# EAGLE schematic P27_v3 (EAGLE 6.5.0)
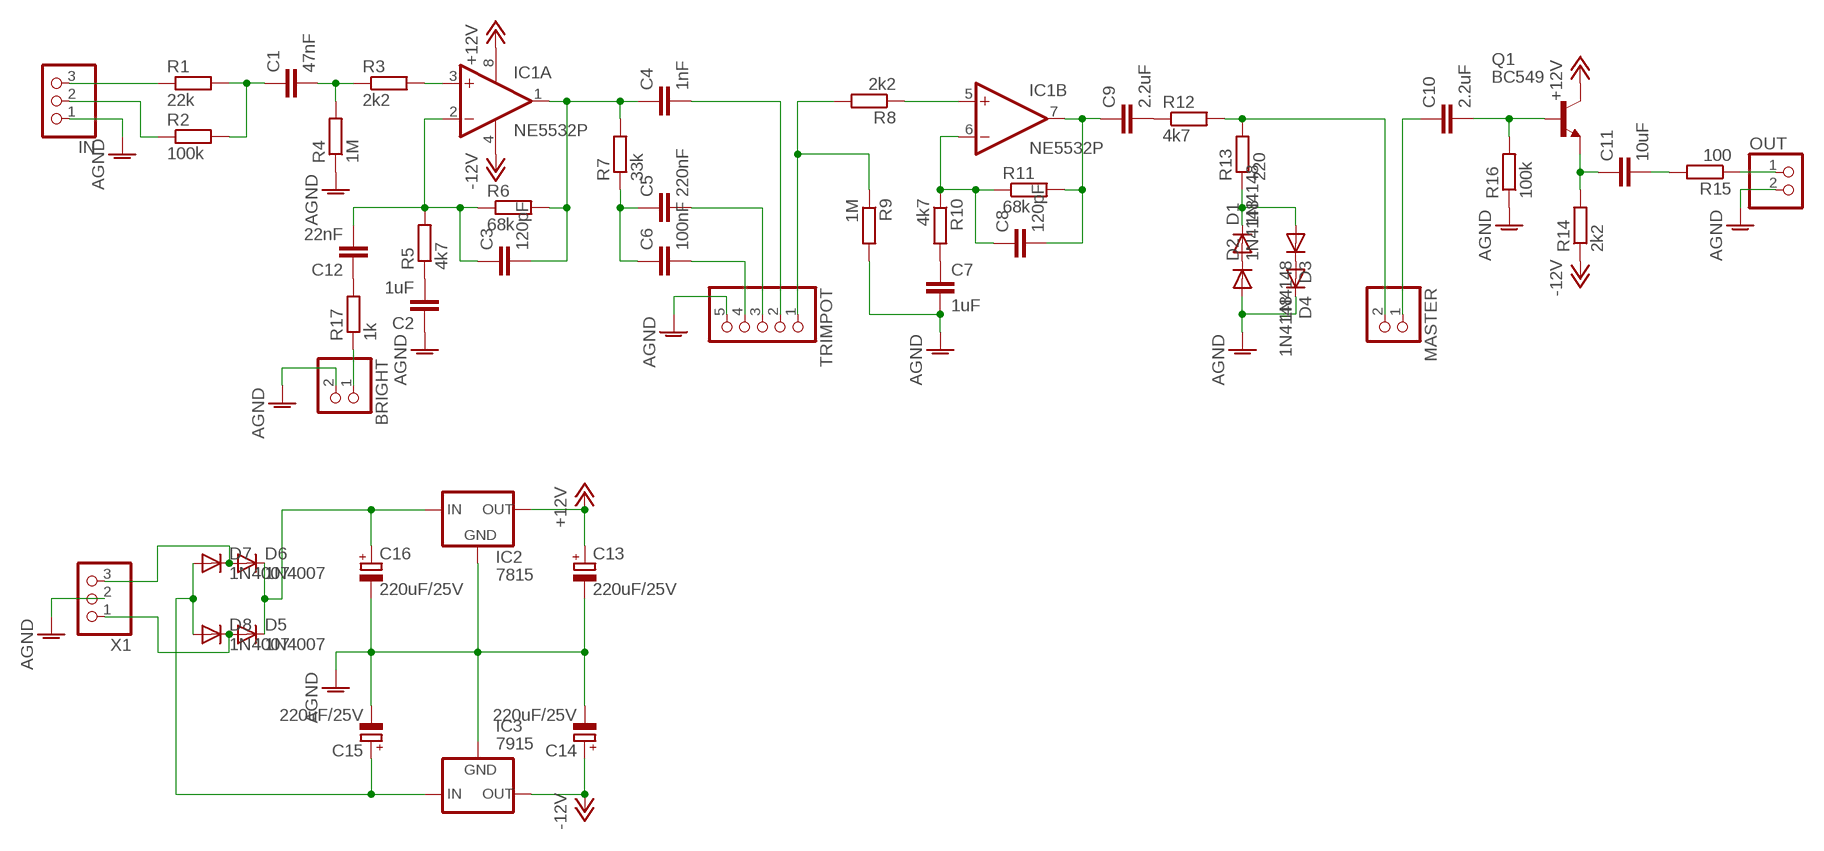
[diagram p0: schematic, sheet 1]

## Parts
BRIGHT  PINHD-1X2  [1X02]
C1  47nF  C-EU050-025X075  [C050-025X075]
C2  1uF  C-EU050-025X075  [C050-025X075]
C3  120pF  C-EU050-025X075  [C050-025X075]
C4  1nF  C-EU050-025X075  [C050-025X075]
C5  220nF  C-EU050-025X075  [C050-025X075]
C6  100nF  C-EU050-025X075  [C050-025X075]
C7  1uF  C-EU050-025X075  [C050-025X075]
C8  120pF  C-EU050-025X075  [C050-025X075]
C9  2.2uF  C-EU050-025X075  [C050-025X075]
C10  2.2uF  C-EU050-025X075  [C050-025X075]
C11  10uF  C-EU050-025X075  [C050-025X075]
C12  22nF  C-EU050-025X075  [C050-025X075]
C13  220uF/25V  CPOL-EUE2.5-6  [E2,5-6]
C14  220uF/25V  CPOL-EUE2.5-6  [E2,5-6]
C15  220uF/25V  CPOL-EUE2.5-6  [E2,5-6]
C16  220uF/25V  CPOL-EUE2.5-6  [E2,5-6]
D1  1N4148  1N4004D  [DO41-7]
D2  1N4148  1N4004D  [DO41-7]
D3  1N4148  1N4004D  [DO41-7]
D4  1N4148  1N4004D  [DO41-7]
D5  1N4007  1N4004D  [DO41-7]
D6  1N4007  1N4004D  [DO41-7]
D7  1N4007  1N4004D  [DO41-7]
D8  1N4007  1N4004D  [DO41-7]
IC1  NE5532P  [DIL08]
IC2  7815  78XXTO-220  [78XXS]
IC3  7915  79XXTO-220  [79XXS]
IN  PINHD-1X3180  [1X03]
MASTER  PINHD-1X2  [1X02]
OUT  PINHD-1X2  [1X02]
Q1  BC549  BC337  [TO92]
R1  22k  R-EU_0207/7  [0207/7]
R2  100k  R-EU_0207/7  [0207/7]
R3  2k2  R-EU_0207/7  [0207/7]
R4  1M  R-EU_0207/7  [0207/7]
R5  4k7  R-EU_0207/7  [0207/7]
R6  68k  R-EU_0207/7  [0207/7]
R7  33k  R-EU_0207/7  [0207/7]
R8  2k2  R-EU_0207/7  [0207/7]
R9  1M  R-EU_0207/7  [0207/7]
R10  4k7  R-EU_0207/7  [0207/7]
R11  68k  R-EU_0207/7  [0207/7]
R12  4k7  R-EU_0207/7  [0207/7]
R13  220  R-EU_0207/7  [0207/7]
R14  2k2  R-EU_0207/7  [0207/7]
R15  100  R-EU_0207/7  [0207/7]
R16  100k  R-EU_0207/7  [0207/7]
R17  1k  R-EU_0207/7  [0207/7]
TRIMPOT  PINHD-1X5  [1X05]
X1  W237-103  [W237-103]

## Nets
+12V: C13.+ IC1.8(A:V+) IC2.OUT Q1.3(C)
-12V: C14.+ IC1.4(A:V-) IC3.OUT R14.1
AGND: BRIGHT.2 C2.1 C7.2 C13.- C14.- C15.- C16.- D2.A D4.C IC2.GND IC3.GND IN.1 OUT.2 R4.1 R9.2 R16.1 TRIMPOT.5 X1.2
N$1: C1.1 R1.2 R2.2
N$2: IC1.3(A:+IN) R3.2
N$3: C1.2 R3.1 R4.2
N$4: C3.1 C12.2 IC1.2(A:-IN) R5.2 R6.1
N$5: C2.2 R5.1
N$6: C3.2 C4.1 IC1.1(A:OUT) R6.2 R7.2
N$7: C6.2 TRIMPOT.4
N$8: C5.1 C6.1 R7.1
N$9: C5.2 TRIMPOT.3
N$10: C4.2 TRIMPOT.2
N$11: C10.2 Q1.2(B) R16.2
N$12: C7.1 R10.2
N$13: R8.2 R9.1 TRIMPOT.1
N$14: IC1.5(B:+IN) R8.1
N$15: C11.1 Q1.1(E) R14.2
N$16: C11.2 R15.2
N$17: C8.1 IC1.6(B:-IN) R10.1 R11.1
N$18: C8.2 C9.1 IC1.7(B:OUT) R11.2
N$19: OUT.1 R15.1
N$20: C9.2 R12.1
N$21: MASTER.2 R12.2 R13.2
N$22: D1.A D2.C
N$23: D3.C D4.A
N$24: D1.C D3.A R13.1
N$25: IN.3 R1.1
N$26: IN.2 R2.1
N$27: C10.1 MASTER.1
N$28: D6.A D7.C X1.3
N$29: C12.1 R17.2
N$30: BRIGHT.1 R17.1
N$31: D5.A D8.C X1.1
N$32: C16.+ D5.C D6.C IC2.IN
N$33: C15.+ D7.A D8.A IC3.IN

## Library data of the parts
BRIGHT MASTER OUT = P27:PINHD-1X2: PIN HEADER
C1-C12 = P27:C-EU: CAPACITOR, European symbol
C13-C16 = P27:CPOL-EU: POLARIZED CAPACITOR, European symbol
D1-D8 = P27:1N4004: DIODE general purpose rectifier, 1 A
IC1 = P27:NE5532: Dual Operational Amplifier Low Power, Single-Supply, Rail-To-Rail Operational Amplifier Source: http://focus.ti.com/lit/ds/symlink/opa2345.pdf http://focus.ti.com .. opa241.pdf http://focus.ti.com/lit/ds/symlink/opa2134.pdf
IC2 = P27:78XX: VOLTAGE REGULATOR
IC3 = P27:79XX: VOLTAGE REGULATOR
IN = P27:PINHD-1X3: PIN HEADER
Q1 = P27:BC337: NPN Transistor
R1-R17 = P27:R-EU_: RESISTOR, European symbol
TRIMPOT = P27:PINHD-1X5: PIN HEADER
X1 = P27:W237-103: WAGO SCREW CLAMP